# EAGLE design atmegaUSBhost (EAGLE 5.09)
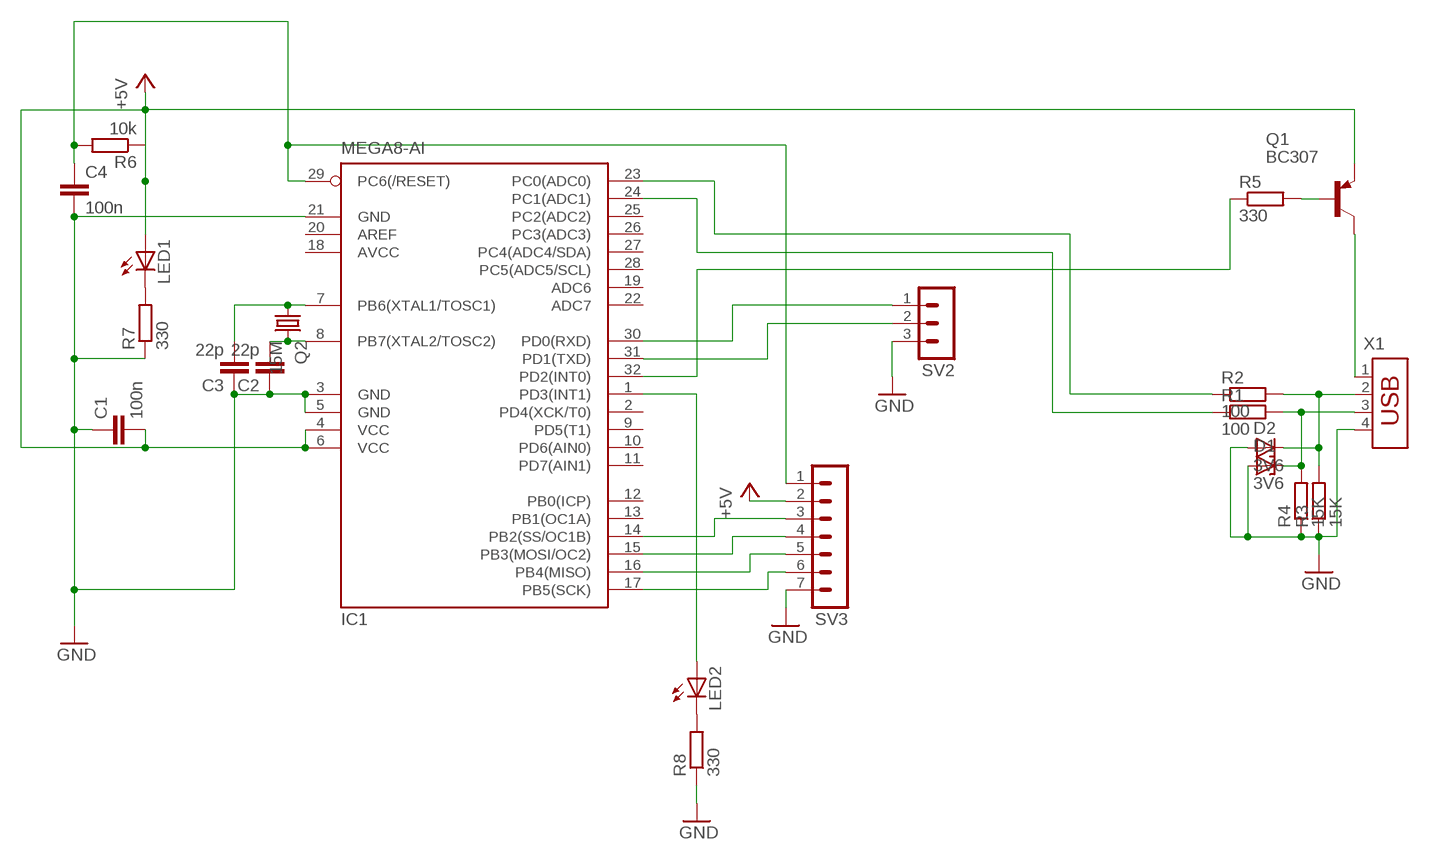
[diagram p0: schematic, sheet 1]

## Parts
C1  100n  C-EUC0805  [C0805]
C2  22p  C-EUC0805  [C0805]
C3  22p  C-EUC0805  [C0805]
C4  100n  C-EUC0805  [C0805]
D1  3V6  ZENER-DIODEZD-5  [ZDIO-5]
D2  3V6  ZENER-DIODEZD-5  [ZDIO-5]
IC1  MEGA8-AI  [TQFP32-08]
LED1  LED3MM  [LED3MM]
LED2  LED3MM  [LED3MM]
Q1  BC307  [TO92]
Q2  15M  CRYSTALHC49U70  [HC49U70]
R1  100  R-EU_0207/10  [0207/10]
R2  100  R-EU_0207/10  [0207/10]
R3  15K  R-EU_0207/10  [0207/10]
R4  15K  R-EU_0207/10  [0207/10]
R5  330  R-EU_0207/10  [0207/10]
R6  10k  R-EU_M0805  [M0805]
R7  330  R-EU_R0805  [R0805]
R8  330  R-EU_R0805  [R0805]
SV2  MA03-1  [MA03-1]
SV3  MA07-1  [MA07-1]
X1  USB-787616  [USB]

## Nets
+5V: C1.2 IC1.4(VCC) IC1.6(VCC) LED1.A Q1.1(E) R6.1 SV3.2
GND: C1.1 C2.1 C3.1 C4.2 D1.A D2.A IC1.3(GND) IC1.5(GND) IC1.21(GND) R3.1 R4.1 R7.1 R8.1 SV2.3 SV3.7 X1.4
N$1: IC1.23(PC0(ADC0)) R2.1
N$2: IC1.24(PC1(ADC1)) R1.1
N$3: IC1.17(PB5(SCK)) SV3.6
N$4: D2.C R2.2 R3.2 X1.2
N$5: D1.C R1.2 R4.2 X1.3
N$6: IC1.16(PB4(MISO)) SV3.5
N$7: IC1.15(PB3(MOSI/OC2)) SV3.4
N$8: IC1.31(PD1(TXD)) SV2.2
N$9: IC1.32(PD2(INT0)) R5.1
N$10: Q1.2(B) R5.2
N$11: Q1.3(C) X1.1
N$13: IC1.14(PB2(SS/OC1B)) SV3.3
N$14: IC1.30(PD0(RXD)) SV2.1
N$15: LED1.K(C) R7.2
N$16: LED2.K(C) R8.2
N$17: C2.2 IC1.8(PB7(XTAL2/TOSC2)) Q2.2
N$18: C4.1 IC1.29(PC6(/RESET)) R6.2 SV3.1
N$19: C3.2 IC1.7(PB6(XTAL1/TOSC1)) Q2.1
N$26: IC1.1(PD3(INT1)) LED2.A
Unconnected: IC1.2(PD4(XCK/T0)) IC1.9(PD5(T1)) IC1.10(PD6(AIN0)) IC1.11(PD7(AIN1)) IC1.12(PB0(ICP)) IC1.13(PB1(OC1A)) IC1.19(ADC6) IC1.20(AREF) IC1.22(ADC7) IC1.25(PC2(ADC2)) IC1.26(PC3(ADC3)) IC1.27(PC4(ADC4/SDA)) IC1.28(PC5(ADC5/SCL))

## Power pins joined to a net without a drawn wire
AVCC: IC1.18(AVCC)

## Library data of the parts
C1-C4 = rcl:C-EU: CAPACITOR, European symbol
D1 D2 = diode:ZENER-DIODE: Z-Diode
IC1 = atmel:MEGA8: MICROCONTROLLER 8 Kbytes FLASH, 1 kbytes SRAM, 512 bytes EEPROM, USART, 6-channel 10 bit ADC, 2-channel 8 bit ADC Pin compatible with Atmega48, ATMega88, ATMega168 Source: avr.lbr
LED1 LED2 = led:LED: LED OSRAM: - CHIPLED LG R971, LG N971, LY N971, LG Q971, LY Q971, LO R971, LY R971 LH N974, LH R974 LS Q976, LO Q976, LY Q976 LO Q996 - Hyper CHIPLED LW Q18S LB Q993, LB Q99A, LB R99A - SideLED LS A670, LO A670, LY A670, LG A670, LP A670 LB A673, LV A673, LT A673, LW A673 LH A674 LY A675 LS A676, LA A676, LO A676, LY A676, LW A676 LS A679, LY A679, LG A679 - Hyper Micro SIDELED® LS Y876, LA Y876, LO Y876, LY Y876 LT Y87S - SmartLED LW L88C, LW L88S LB L89C, LB L89S, LG L890 LS L89K, LO L89K, LY L89K LS L896, LA L896, LO L896, LY L896 - TOPLED LS T670, LO T670, LY T670, LG T670, LP T670 LSG T670, LSP T670, LSY T670, LOP T670, LYG T670 LG T671, LOG T671, LSG T671 LB T673, LV T673, LT T673, LW T673 LH T674 LS T676, LA T676, LO T676, LY T676, LB T676, LH T676, LSB T676, LW T676 LB T67C, LV T67C, LT T67C, LS T67K, LO T67K, LY T67K, LW E67C LS E67B, LA E67B, LO E67B, LY E67B, LB E67C, LV E67C, LT E67C LW T67C LS T679, LY T679, LG T679 LS T770, LO T770, LY T770, LG T770, LP T770 LB T773, LV T773, LT T773, LW T773 LH T774 LS E675, LA E675, LY E675, LS T675 LS T776, LA T776, LO T776, LY T776, LB T776 LHGB T686 LT T68C, LB T68C - Hyper Mini TOPLED® LB M676 - Mini TOPLED Santana® LG M470 LS M47K, LO M47K, LY M47K Source: http://www.osram.convergy.de LUXEON: - LUMILED® LXK2-PW12-R00, LXK2-PW12-S00, LXK2-PW14-U00, LXK2-PW14-V00 LXK2-PM12-R00, LXK2-PM12-S00, LXK2-PM14-U00 LXK2-PE12-Q00, LXK2-PE12-R00, LXK2-PE12-S00, LXK2-PE14-T00, LXK2-PE14-U00 LXK2-PB12-K00, LXK2-PB12-L00, LXK2-PB12-M00, LXK2-PB14-N00, LXK2-PB14-P00, LXK2-PB14-Q00 LXK2-PR12-L00, LXK2-PR12-M00, LXK2-PR14-Q00, LXK2-PR14-R00 LXK2-PD12-Q00, LXK2-PD12-R00, LXK2-PD12-S00 LXK2-PH12-R00, LXK2-PH12-S00 LXK2-PL12-P00, LXK2-PL12-Q00, LXK2-PL12-R00 Source: www.luxeon.com KINGBRIGHT: KA-3528ASYC Source: www.kingbright.com
Q1 = transistor-pnp:BC307: PNP Transistor
Q2 = crystal:CRYSTAL: CRYSTAL
R1-R5 R7 R8 = resistor:R-EU_: RESISTOR, European symbol
R6 = rcl:R-EU_: RESISTOR, European symbol
SV2 = con-lstb:MA03-1: PIN HEADER
SV3 = con-lstb:MA07-1: PIN HEADER
X1 = con-amp:USB-787616: AMP connector

## Net classes
0 default: clearance 0.15 mm

## Board
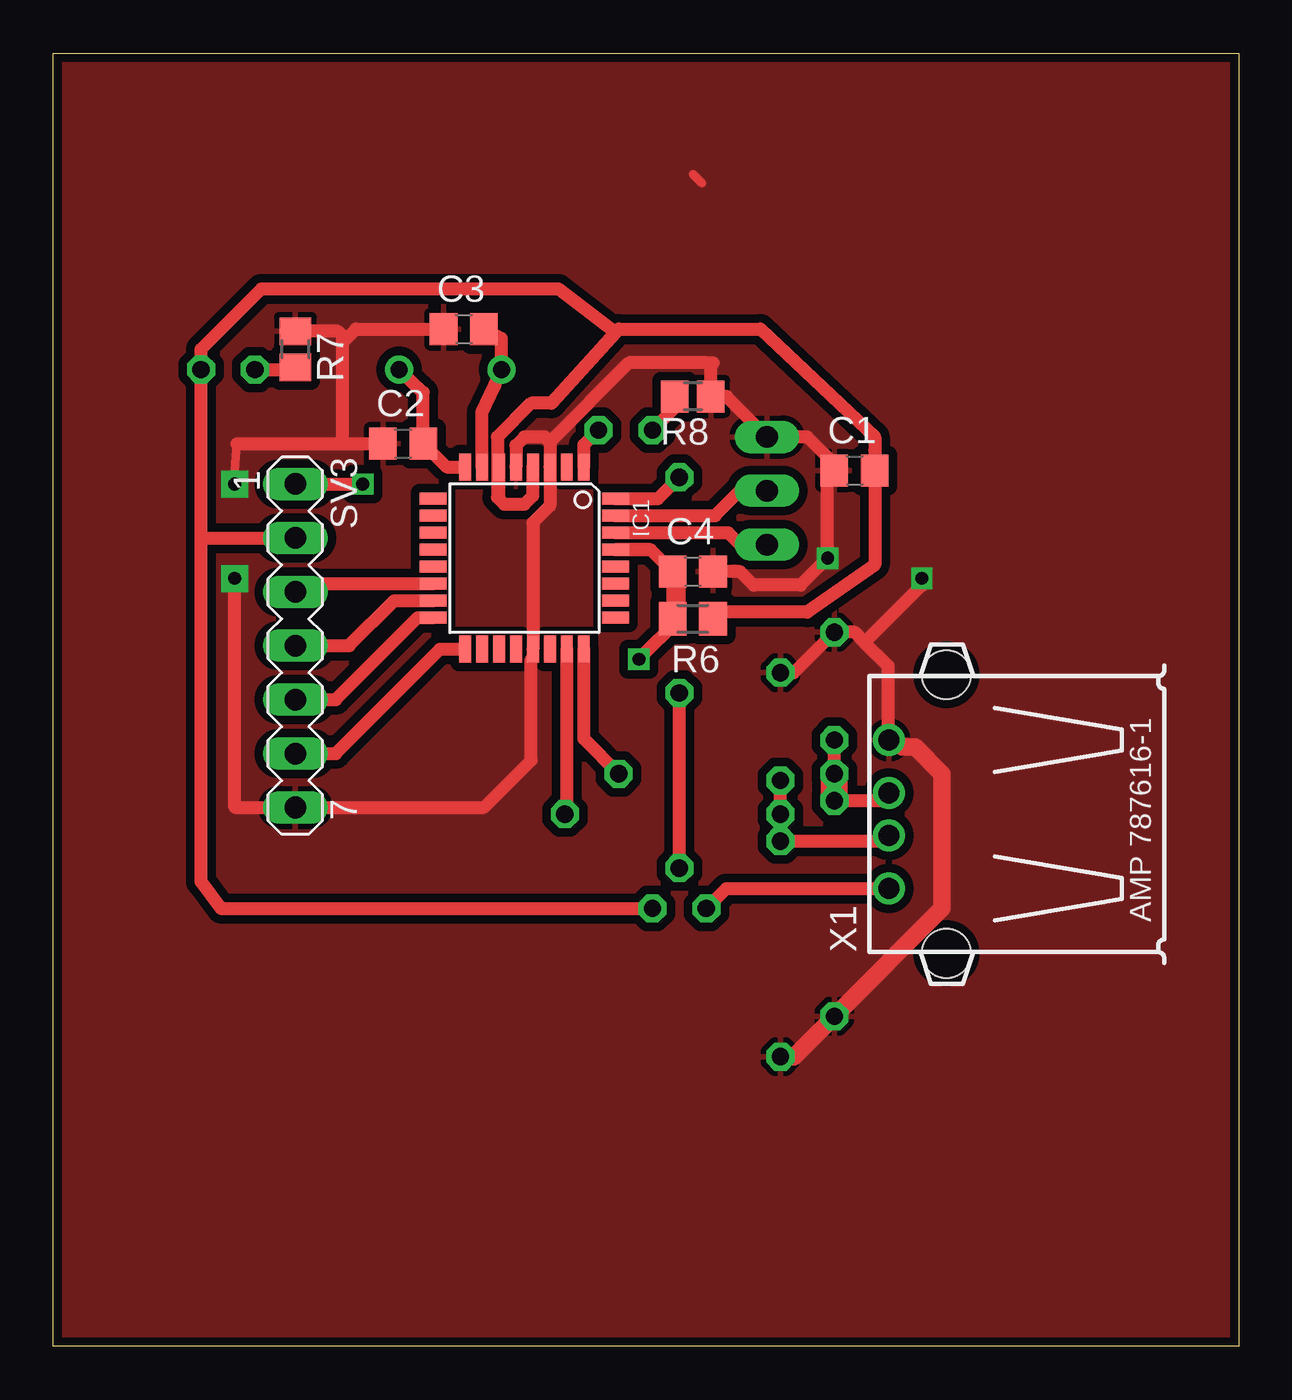
[diagram p1: board, top side]
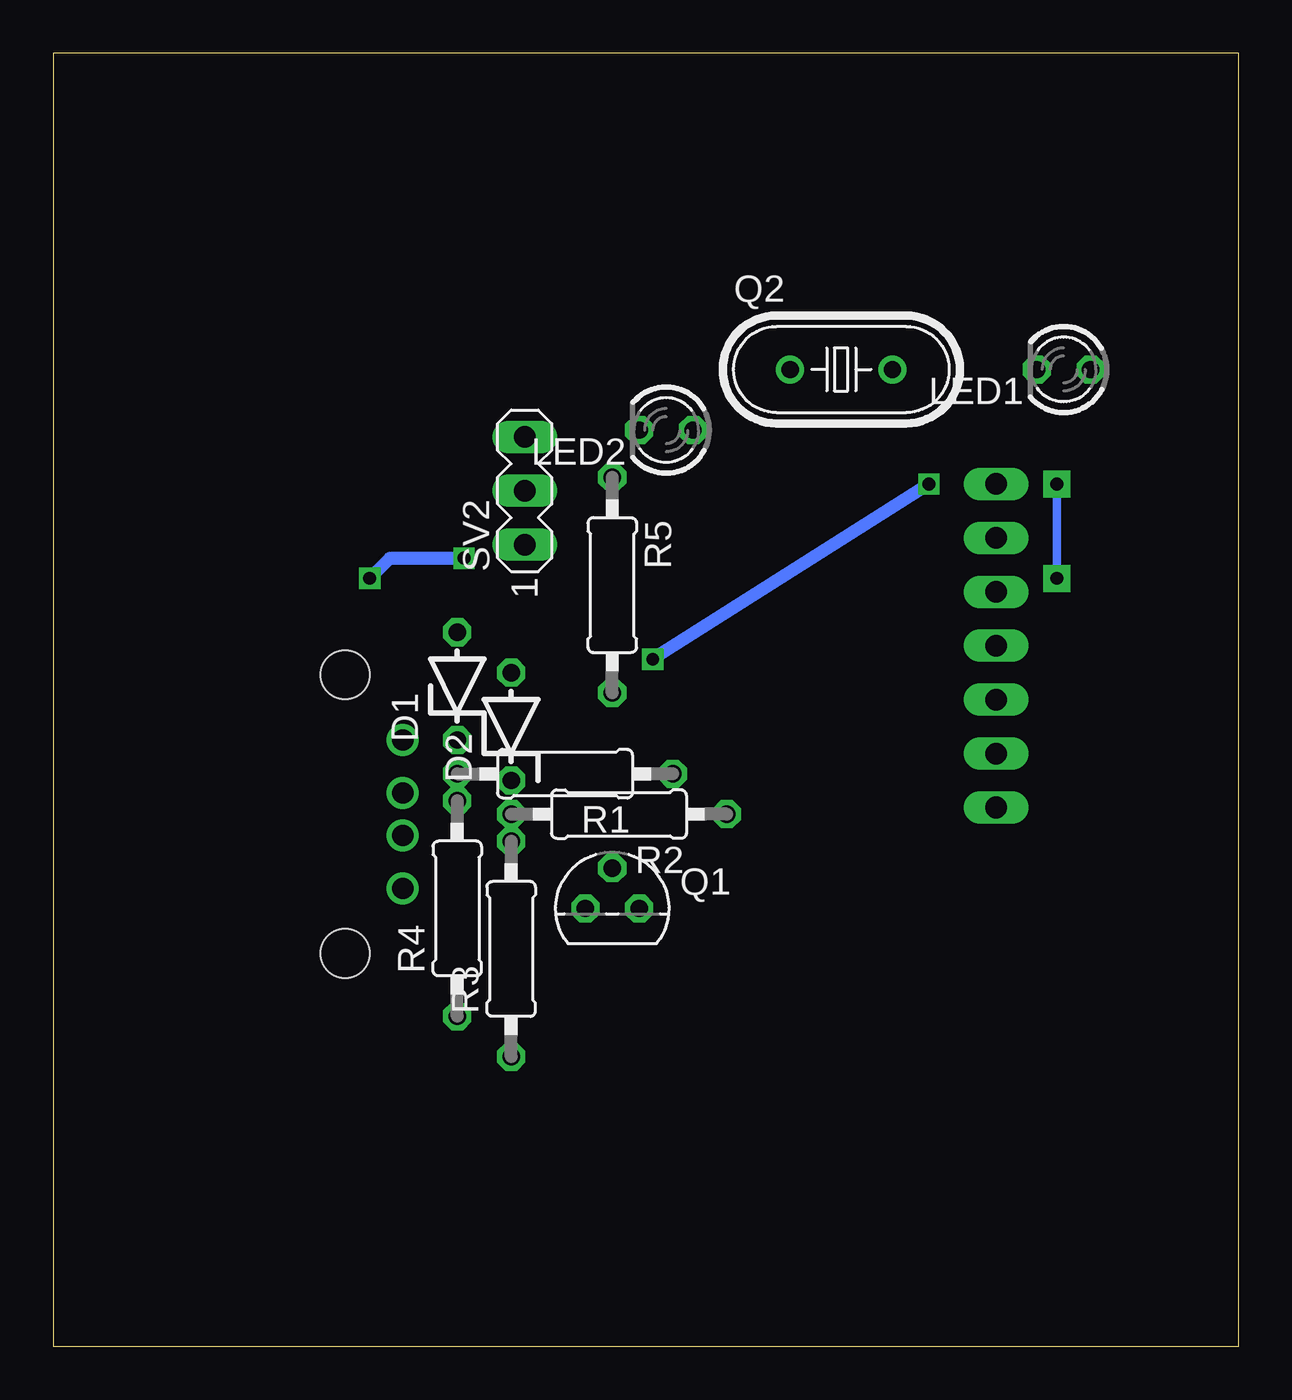
[diagram p2: board, bottom side, seen from below]

Size 55.87 x 60.95 mm. Coordinates in mm from the lower left corner, seen from the top.
Outline: 55.87,0 0,0 0,60.95 55.87,60.95 55.87,0
Copper layers (1*16): Top 0.035mm / dielectric 1.5mm / Bottom 0.035mm
Design rules "default *": minimum track width 10mil, minimum drill 24mil, track to track 8mil, track to pad 8mil, pad to pad 8mil, via to via 8mil, smd to smd 8mil, copper to edge 0.1mm, drill to drill 8mil, minimum pad ring 10mil, minimum via ring 8mil, stop-mask expansion 4mil, vias tented up to drill 0mil, thermal gap 10mil

### Footprints (pad centres in the part's own frame; a part is rotated, then mirrored left to right if it is on the bottom)
C0805 = smd 1.3 x 1.5: 1 -0.95,0; 2 0.95,0
ZDIO-5 = drill 0.813 octagon: A 2.54,0; C -2.54,0
TQFP32-08 = smd 1.27 x 0.559: 1 -4.293,2.8; 2 -4.293,2; 3 -4.293,1.2; 4 -4.293,0.4; 5 -4.293,-0.4; 6 -4.293,-1.2; 7 -4.293,-2; 8 -4.293,-2.8; 17 4.293,-2.8; 18 4.293,-2; 19 4.293,-1.2; 20 4.293,-0.4; 21 4.293,0.4; 22 4.293,1.2; 23 4.293,2; 24 4.293,2.8 | smd 0.559 x 1.27: 9 -2.8,-4.293; 10 -2,-4.293; 11 -1.2,-4.293; 12 -0.4,-4.293; 13 0.4,-4.293; 14 1.2,-4.293; 15 2,-4.293; 16 2.8,-4.293; 25 2.8,4.293; 26 2,4.293; 27 1.2,4.293; 28 0.4,4.293; 29 -0.4,4.293; 30 -1.2,4.293; 31 -2,4.293; 32 -2.8,4.293
LED3MM = drill 0.813 octagon: A -1.27,0; K 1.27,0
TO92 = drill 0.813 octagon: 1 1.27,0; 2 0,1.905; 3 -1.27,0
HC49U70 = drill 0.813 round: 1 -2.413,0; 2 2.413,0
0207/10 = drill 0.813 octagon: 1 -5.08,0; 2 5.08,0
M0805 = smd 1.3 x 1.6: 1 -0.95,0; 2 0.95,0
R0805 = smd 1.3 x 1.5: 1 -0.85,0; 2 0.85,0
MA03-1 = drill 1.016 long: 1 -2.54,0; 2 0,0; 3 2.54,0
MA07-1 = drill 1.016 long: 1 -7.62,0; 2 -5.08,0; 3 -2.54,0; 4 0,0; 5 2.54,0; 6 5.08,0; 7 7.62,0
USB = drill 1 round: 1 -3.5,12.99; 2 -1,12.99; 3 1,12.99; 4 3.5,12.99 | hole 2.3: -6.57,10.28; 6.57,10.28

### Placement (x,y rotation side)
C1  37.77,41.27 0 top
C2  16.5,42.55 0 top
C3  19.36,47.94 0 top
C4  30.15,36.51 0 top
D1  36.82,31.11 90 bottom
D2  34.28,29.21 90 bottom
IC1  22.21,37.15 270 top
LED1  8.24,46.04 180 bottom
LED2  26.98,43.18 180 bottom
Q1  29.52,20.64 0 bottom
Q2  18.72,46.04 0 bottom
R1  31.74,26.99 180 bottom
R2  29.2,25.08 180 bottom
R3  34.28,18.73 90 bottom
R4  36.82,20.64 90 bottom
R5  29.52,35.88 270 bottom
R6  30.15,34.29 180 top
R7  11.42,46.99 270 top
R8  30.15,44.77 180 top
SV2  33.64,40.32 90 bottom
SV3  11.42,33.02 270 top
X1  52.38,25.08 90 top

### Tracks (layer width: path | path; a pad name or v marks a point on that pad's centre or on a via)
+5V
  Top 0.61: IC1.4 22.61,40.09 22.21,39.69 21.26,39.69 20.94,40.01 | IC1.6 21.01,40.08 20.94,40.01 | 20.94,40.01 20.94,42.86 22.53,44.45 23.48,44.45 26.5,47.78 | 26.5,47.78 26.66,47.94 33.32,47.94 38.72,42.86 38.72,42.23 | 38.72,42.23 38.72,36.83 35.55,34.61 31.42,34.61 R6.1 | 6.97,38.1 SV3.2 | 6.97,38.1 LED1.A 6.97,46.99 9.83,49.85 23.8,49.85 26.5,47.78 | C1.2 38.72,42.23 | Q1.1 7.93,20.64 6.97,21.91 6.97,38.1
GND  (via drill 0.6, 0.6 pad 1.27)
  Top 0.406: 30.15,55.24 30.57,54.83 | v8.56,40.64 8.56,41.27 8.66,42.55
  Top 0.61: v8.56,36.2 8.56,25.4 SV3.7 20.31,25.4 22.53,27.62 22.53,32.38 | D2.A 34.91,31.75 D1.A 37.77,33.66 38.25,33.18 | 38.25,33.18 39.36,32.07 39.36,28.61 X1.4 | IC1.21 22.61,38.82 23.41,39.62 IC1.3 23.41,42.62 | IC1.5 21.81,42.46 22.21,42.86 23.16,42.86 23.41,42.62 | C4.2 32.37,36.51 33.01,35.88 35.23,35.88 v36.5,37.15 36.5,41.91 | 36.5,41.91 35.55,42.86 SV2.3 31.74,44.77 R8.1 31,46.14 30.78,46.35 | 30.78,46.35 27.15,46.35 23.41,42.62 | 13.64,42.55 C2.1 | 8.66,42.55 13.64,42.55 | R7.1 13.43,47.84 13.64,47.62 13.64,47.31 | 13.64,42.55 13.64,47.31 | C3.1 14.27,47.94 13.64,47.31 | C1.1 36.82,41.59 36.5,41.91 | v40.95,36.2 40.95,35.88 38.25,33.18 | 30.78,46.35 31.1,46.35
  Top 0.813: R3.1 34.91,13.65 R4.1 41.9,20.64 41.9,26.99 40.63,28.26 40.03,28.26 X1.4
  Bottom 0.406: v8.56,36.2 v8.56,40.64
  Bottom 0.61: v36.5,37.15 39.99,37.15 v40.95,36.2
  pour Top (isolate 0.406): 56.18,-0.32 -0.65,-0.32 -0.33,61.91 56.82,61.59
N$1
  Top 0.61: IC1.23 24.21,25.18 R2.1
N$2
  Top 0.61: IC1.24 25.01,28.63 R1.1
N$3
  Top 0.61: IC1.17 18.24,32.85 13.32,27.94 SV3.6
N$4
  Top 0.406: R3.2 34.28,23.5
  Top 0.61: X1.2 39.43,23.81 R3.2 R2.2 D2.C
N$5
  Top 0.61: R4.2 39.34,25.72 X1.3 | R1.2 D1.C
  Top 1.27: R4.2 R1.2
N$6
  Top 0.61: IC1.16 17.19,34.35 13.32,30.48 SV3.5
N$7
  Top 0.61: IC1.15 16.09,35.15 13.96,33.02 SV3.4
N$8
  Top 0.61: IC1.31 31.2,39.15 32.37,40.32 SV2.2
N$9
  Top 0.61: IC1.32 28.5,39.95 R5.1
N$10
  Top 0.61: Q1.2 R5.2
N$11
  Top 0.61: X1.1 31.73,21.58 Q1.3
N$13
  Top 0.61: IC1.14 11.81,35.95 SV3.3
N$14
  Top 0.61: IC1.30 31.81,38.35 32.37,37.78 SV2.1
N$15
  Top 0.61: LED1.K 11.32,46.04 R7.2
N$16
  Top 0.61: R8.2 29.3,44.23 LED2.K
N$17
  Top 0.61: IC1.8 18.55,41.44 C2.2 17.45,44.96 Q2.2
N$18  (via drill 0.6)
  Top 0.61: R6.2 C4.1 28.16,37.55 IC1.29 28.16,37.55 29.51,36.2 29.51,34.29 v27.61,32.38 | SV3.1 v14.59,40.64
  Bottom 0.61: v14.59,40.64 v27.61,32.38
N$19
  Top 0.61: IC1.7 20.21,44.04 20.82,45.28 Q2.1 21.13,47.49 C3.2
N$26
  Top 0.61: IC1.1 25.01,42.49 LED2.A